# Altium schematic sheet DC-DC.SchDoc
size A4; SheetNumber: 2; SheetTotal: 5
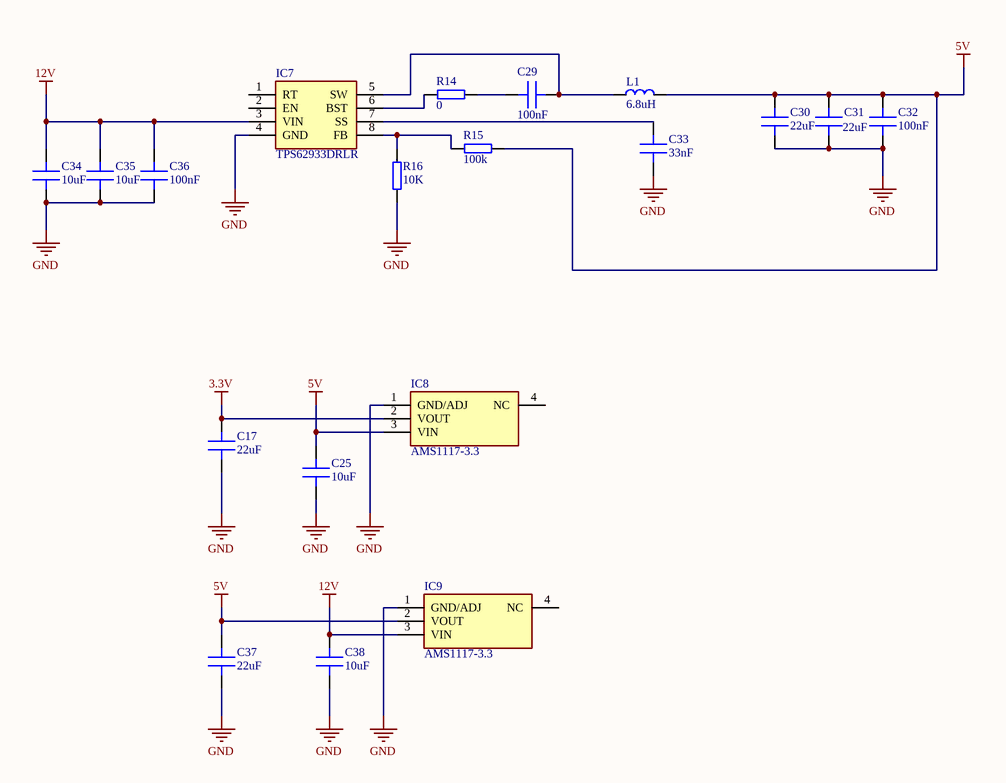
[diagram p0: DC-DC.SchDoc]

## Parts
C17  22uF  [C 0805]
C25  10uF  [C 0805]
C29  100nF  [C 0402]
C30  22uF  [C 1206]
C31  22uF  [C 1206]
C32  100nF  [C 0603]
C33  33nF  [C 0402]
C34  10uF  [C 1206]
C35  10uF  [C 1206]
C36  100nF  [C 0603]
C37  22uF  [C 0805]
C38  10uF  [C 0805]
IC7  TPS62933DRLR  [SOTFL50P160X60-8N]
IC8  AMS1117-3.3  [SOT229P700X180-4N]
IC9  AMS1117-3.3  [SOT229P700X180-4N]
L1  6.8uH  [HPI0630]
R14  0  [R 0402]
R15  100k  [R 0402]
R16  10K  [R 0402]

## Nets
3.3V: C17.1 IC8.2(VOUT)
5V: C25.1 C30.1 C31.1 C32.1 C37.1 IC8.3(VIN) IC9.2(VOUT) L1.2 R15.1
12V: C34.1 C35.1 C36.1 C38.1 IC7.3(VIN) IC9.3(VIN)
GND: C17.2 C25.2 C30.2 C31.2 C32.2 C33.2 C34.2 C35.2 C36.2 C37.2 C38.2 IC7.4(GND) IC8.1(GND/ADJ) IC9.1(GND/ADJ) R16.1
NetC29_1: C29.1 R14.1
NetC29_2: C29.2 IC7.5(SW) L1.1
NetC33_1: C33.1 IC7.7(SS)
NetIC7_6: IC7.6(BST) R14.2
NetIC7_8: IC7.8(FB) R15.2 R16.2

Not connected (* = marked no-connect by the designer): IC7 1(RT) 2(EN); IC8 4(NC); IC9 4(NC)

## Library data of the parts
C17 C25 C29-C38 = Capacitor: MLCC Capacitor
IC7 = TPS62933DRLR: Integrated Circuit; Manufacturer_Name: Texas Instruments; Datasheet Link: https://www.ti.com/lit/ds/symlink/tps62933.pdf?ts=1626073394234; Height: 0.6mm; Manufacturer_Part_Number: TPS62933DRLR; Mouser Part Number: 595-TPS62933DRLR; Mouser Price/Stock: https://www.mouser.co.uk/ProductDetail/Texas-Instruments/TPS62933DRLR?qs=Rp5uXu7WBW9fv47wfQVntQ%3D%3D; Arrow Part Number: TPS62933DRLR; Arrow Price/Stock: https://www.arrow.com/en/products/tps62933drlr/texas-instruments?utm_currency=USD&region=nac
IC8 IC9 = AMS1117-3.3: Integrated Circuit; Manufacturer_Name: Advanced; Datasheet Link: https://datasheet.datasheetarchive.com/originals/distributors/Datasheets-28/DSA-550594.pdf; Height: 1.8mm; Manufacturer_Part_Number: AMS1117-3.3
L1 = Inductor: General pourpouse inductor
R14-R16 = Resistor: General pourpouse resistor